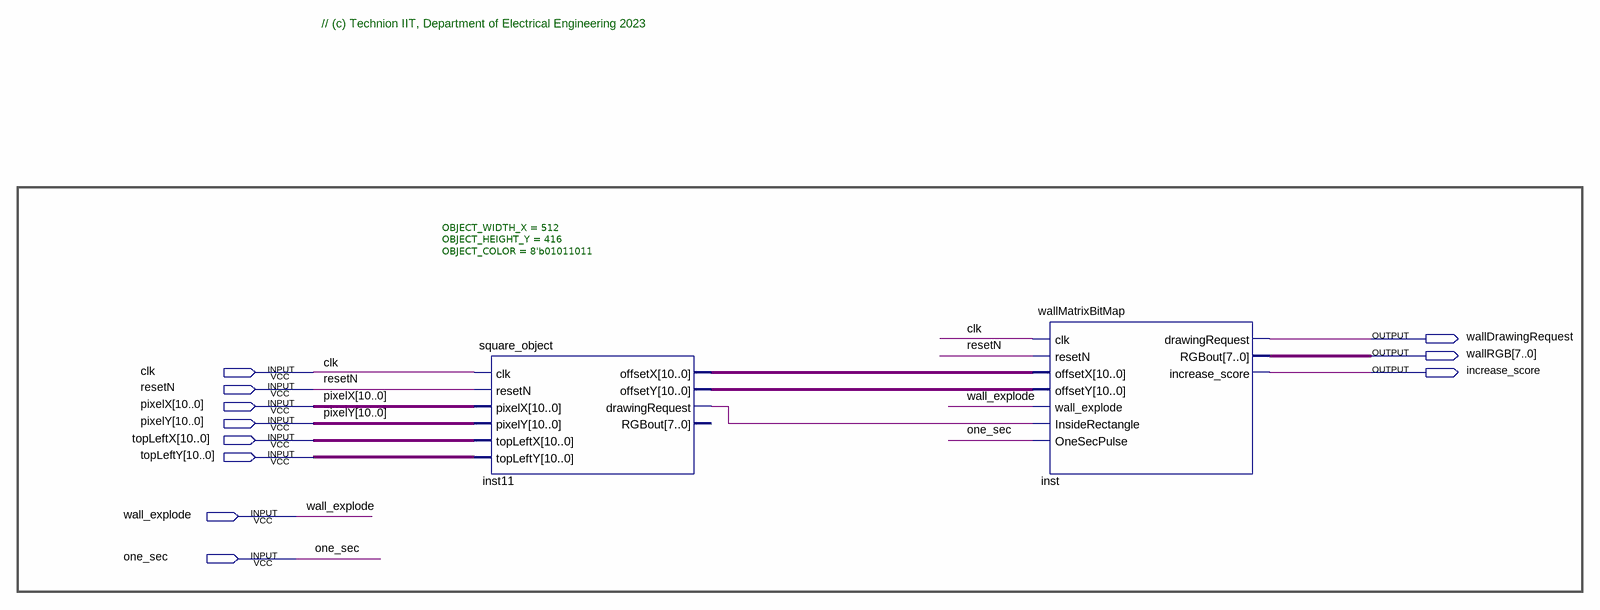
[diagram p0: schematic sheet]
// Quartus schematic wall_DISPLAY.bdf as structural Verilog: 2 symbols, 11 pins
module wall_DISPLAY (
  input  clk,
  input  resetN,
  input  [10:0] pixelX,
  input  [10:0] pixelY,
  input  [10:0] topLeftX,
  input  [10:0] topLeftY,
  input  wall_explode,
  input  one_sec,
  output wallDrawingRequest,
  output [7:0] wallRGB,
  output increase_score
);

  wire inst11_drawingrequest;
  wire [10:0] inst11_offsetx, inst11_offsety;

  square_object #(.OBJECT_WIDTH_X(512), .OBJECT_HEIGHT_Y(416), .OBJECT_COLOR(8'b01011011)) inst11 (
    .clk(clk), .resetN(resetN), .pixelX(pixelX), .pixelY(pixelY), .topLeftX(topLeftX), .topLeftY(topLeftY),
    .offsetX(inst11_offsetx), .offsetY(inst11_offsety), .drawingRequest(inst11_drawingrequest));  // open: RGBout
  wallMatrixBitMap inst (
    .clk(clk), .resetN(resetN), .offsetX(inst11_offsetx), .offsetY(inst11_offsety),
    .wall_explode(wall_explode), .InsideRectangle(inst11_drawingrequest), .OneSecPulse(one_sec),
    .drawingRequest(wallDrawingRequest), .RGBout(wallRGB), .increase_score(increase_score));

  // Notes on the sheet:
  //   // (c) Technion IIT, Department of Electrical Engineering 2023
endmodule
